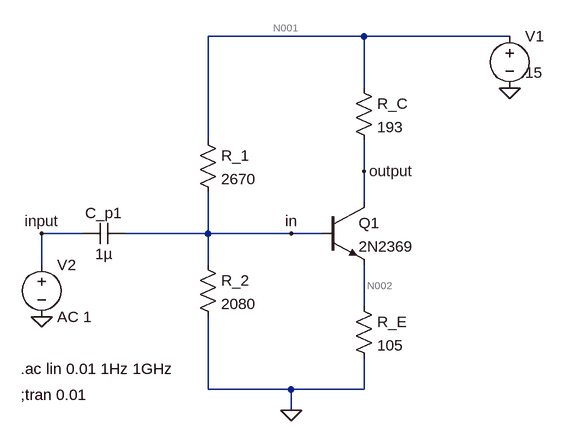
[diagram p0: schematic Draft2.asc]
Draft2.asc, the LTspice schematic file:
Version 4
SHEET 1 880 680
WIRE 432 -64 192 -64
WIRE 656 -64 432 -64
WIRE 432 16 432 -64
WIRE 192 96 192 -64
WIRE 432 144 432 96
WIRE 432 192 432 144
WIRE 0 240 -64 240
WIRE 192 240 192 176
WIRE 192 240 64 240
WIRE 320 240 192 240
WIRE 368 240 320 240
WIRE -64 288 -64 240
WIRE 192 288 192 240
WIRE 432 352 432 288
WIRE 192 480 192 368
WIRE 320 480 192 480
WIRE 432 480 432 432
WIRE 432 480 320 480
WIRE 320 512 320 480
FLAG 656 16 0
FLAG -64 368 0
FLAG 320 512 0
FLAG -64 240 input
FLAG 432 144 output
FLAG 320 240 in
SYMBOL npn 368 192 R0
SYMATTR InstName Q1
SYMATTR Value 2N2369
SYMBOL voltage 656 -80 R0
WINDOW 123 24 44 Left 2
WINDOW 39 0 0 Left 0
WINDOW 3 24 72 Left 2
SYMATTR Value 15
SYMATTR InstName V1
SYMBOL res 416 0 R0
SYMATTR InstName R_C
SYMATTR Value 193
SYMBOL res 416 336 R0
SYMATTR InstName R_E
SYMATTR Value 105
SYMBOL res 176 272 R0
SYMATTR InstName R_2
SYMATTR Value 2080
SYMBOL res 176 80 R0
SYMATTR InstName R_1
SYMATTR Value 2670
SYMBOL cap 64 224 R90
WINDOW 0 0 32 VBottom 2
WINDOW 3 32 32 VTop 2
SYMATTR InstName C_p1
SYMATTR Value 1µ
SYMBOL voltage -64 272 R0
WINDOW 123 0 0 Left 0
WINDOW 39 0 0 Left 0
SYMATTR InstName V2
SYMATTR Value AC 1
TEXT -96 488 Left 2 !;tran 0.01
TEXT -96 448 Left 2 !.ac lin 0.01 1Hz 1GHz

The netlist it stands for:
* Draft2.asc
Q1 output in N002 0 2N2369
V1 N001 0 15
R_C N001 output 193
R_E N002 0 105
R_2 in 0 2080
R_1 N001 in 2670
C_p1 in input 1µ
V2 input 0 AC 1
.model NPN NPN
.model PNP PNP
.lib standard.bjt
;tran 0.01
.ac lin 0.01 1Hz 1GHz
.backanno
.end

* Results of the author's LTspice run, read from the files saved beside the schematic
* Operating Point, zero values left out:
*   V(output) = 5.955 V
*   V(in) = 5.723 V
*   V(n002) = 4.997 V
*   V(n001) = 15 V
*   Ic(Q1) = 46.87 mA
*   Ib(Q1) = 722.7 µA
*   Ie(Q1) = -47.59 mA
*   I(R_c) = 46.87 mA
*   I(R_e) = 47.59 mA
*   I(R_2) = 2.752 mA
*   I(R_1) = 3.474 mA
*   I(V1) = -50.34 mA
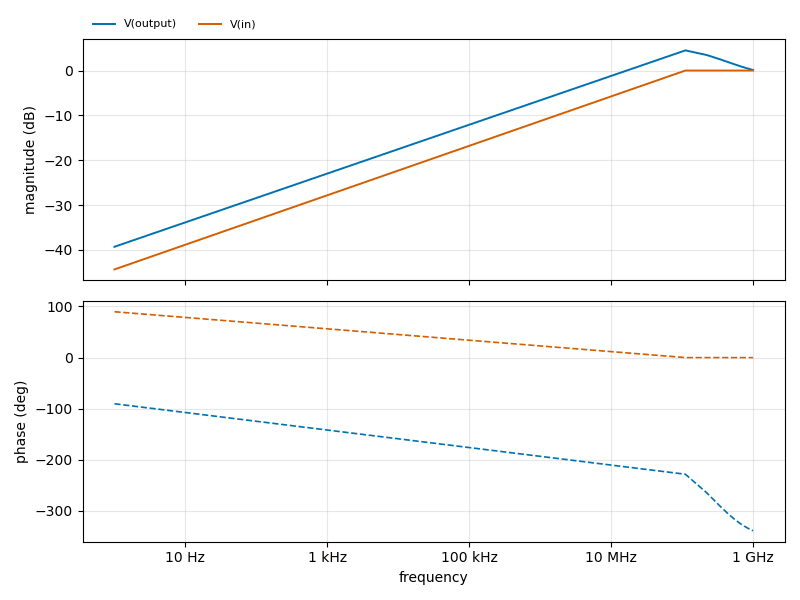
[diagram p1: AC Analysis of Draft2.asc, plotted from the saved traces]
* AC Analysis, 1 run:
*   V(output): -39.28 dB at 1 Hz, 0.12 dB at 1 GHz, peak 4.49 dB at 111.1 MHz, 3 dB below the peak at 31.08 MHz and 527.1 MHz
*   V(in): -44.33 dB at 1 Hz, -0.00 dB at 1 GHz, peak -0.00 dB at 1 GHz, 3 dB below the peak at 31.58 MHz